# Altium project igbtDriver.PrjPcb
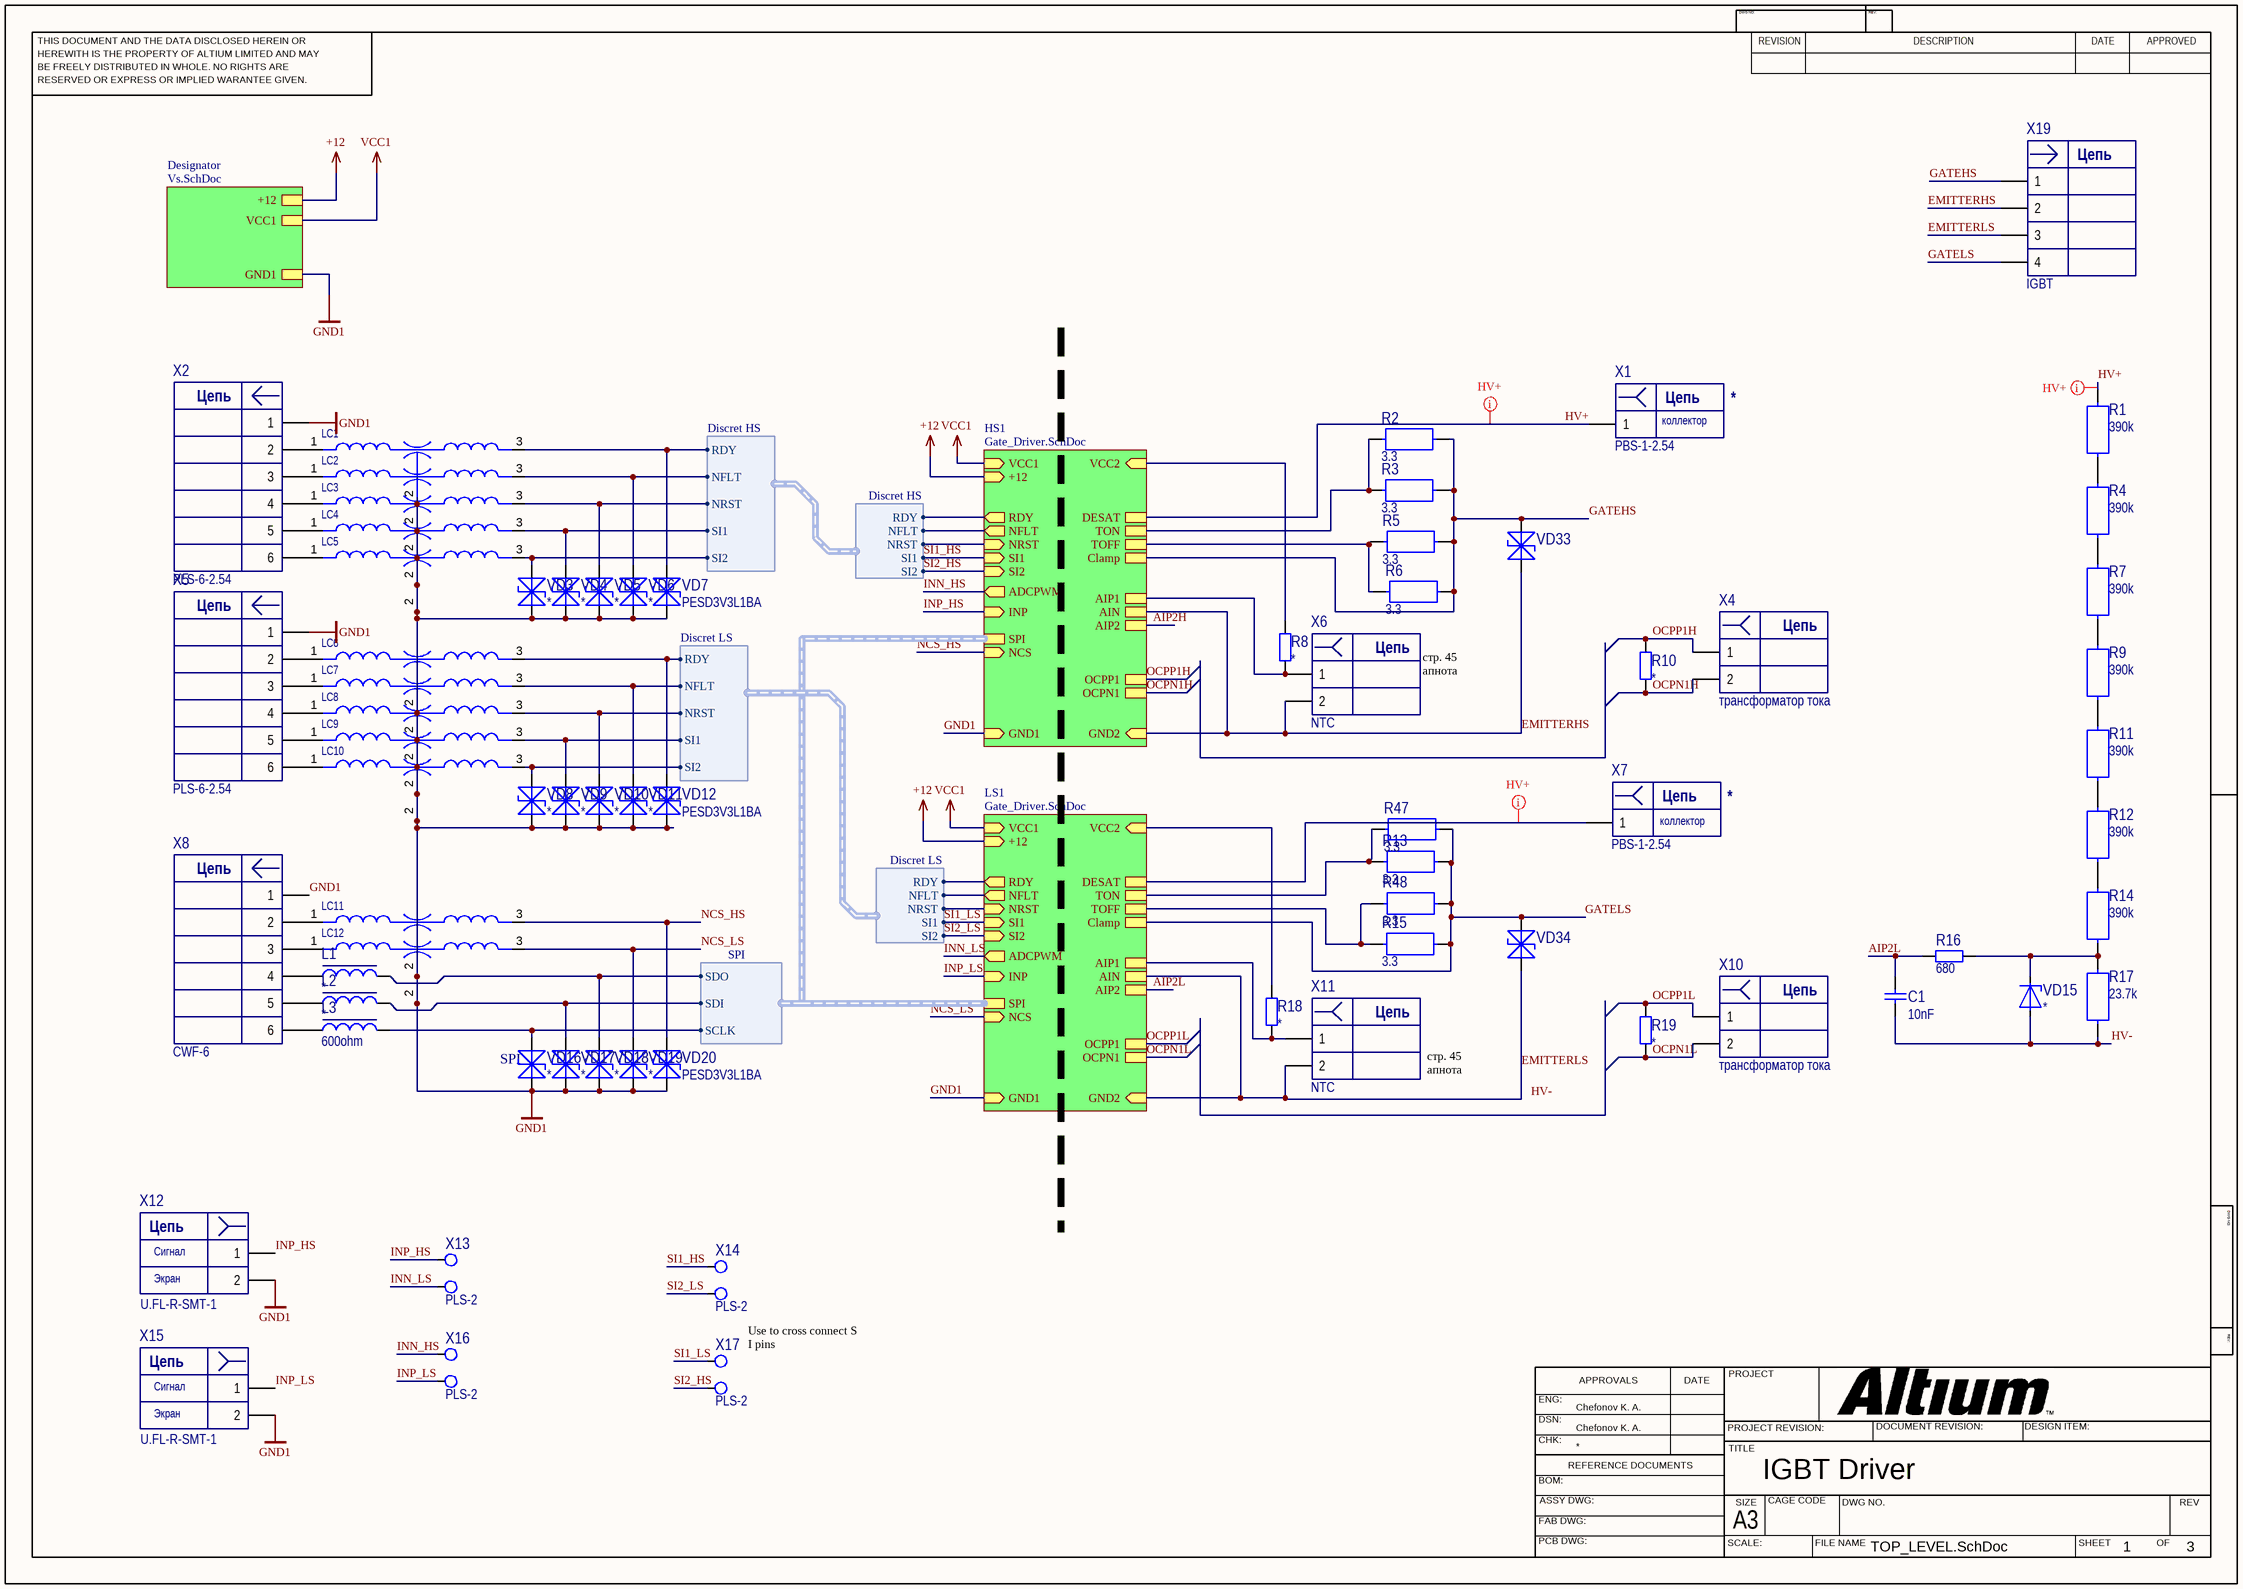
[diagram p0: TOP_LEVEL.SchDoc]
3 sheets, 239 parts. Net scope: strictly hierarchical (ports join the sheet entries above them; power ports are local).
Board file: PCB.PcbDoc
Sheets:
  TOP_LEVEL.SchDoc
    HS1 = Gate_Driver.SchDoc
    LS1 = Gate_Driver.SchDoc
    Designator = Vs.SchDoc

## Sheet TOP_LEVEL.SchDoc: IGBT Driver
size 420 x 297 mm; ApprovedBy: Chefonov K. A.; Author: Chefonov K. A.; CompanyName: Xtronik; DrawnBy: Chefonov K. A.; Engineer: Chefonov K. A.; Organization: Xtronik; Revision: 1; SheetNumber: 1; SheetTotal: 3

### Parts
C1  10nF  [2012[0805]]
L1  *  [2012[0805]]
L2  *  [2012[0805]]
L3  600ohm  [2012[0805]]
LC1  (no value)  [NFE61PT102E1H9L]
LC2  (no value)  [NFE61PT102E1H9L]
LC3  (no value)  [NFE61PT102E1H9L]
LC4  (no value)  [NFE61PT102E1H9L]
LC5  (no value)  [NFE61PT102E1H9L]
LC6  (no value)  [NFE61PT102E1H9L]
LC7  (no value)  [NFE61PT102E1H9L]
LC8  (no value)  [NFE61PT102E1H9L]
LC9  (no value)  [NFE61PT102E1H9L]
LC10  (no value)  [NFE61PT102E1H9L]
LC11  (no value)  [NFE61PT102E1H9L]
LC12  (no value)  [NFE61PT102E1H9L]
R1  390k  [3225[1210]]
R2  3.3  [2512]
R3  3.3  [2512]
R4  390k  [3225[1210]]
R5  3.3  [2512]
R6  3.3  [2512]
R7  390k  [3225[1210]]
R8  *  [2012[0805]]
R9  390k  [3225[1210]]
R10  *  [2012[0805]]
R11  390k  [3225[1210]]
R12  390k  [3225[1210]]
R13  3.3  [2012[0805]]
R14  390k  [3225[1210]]
R15  3.3  [2012[0805]]
R16  680  [2012[0805]]
R17  23.7k  [2012[0805]]
R18  *  [2012[0805]]
R19  *  [2012[0805]]
R47  3.3  [2012[0805]]
R48  3.3  [2012[0805]]
VD3  *  [SOD-323]
VD4  *  [SOD-323]
VD5  *  [SOD-323]
VD6  *  [SOD-323]
VD7  PESD3V3L1BA  [SOD-323]
VD8  *  [SOD-323]
VD9  *  [SOD-323]
VD10  *  [SOD-323]
VD11  *  [SOD-323]
VD12  PESD3V3L1BA  [SOD-323]
VD15  *  [SOD-123]
VD16  *  [SOD-323]
VD17  *  [SOD-323]
VD18  *  [SOD-323]
VD19  *  [SOD-323]
VD20  PESD3V3L1BA  [SOD-323]
VD33  (no value)  [SMС]
VD34  (no value)  [SMС]
X1  PBS-1-2.54  [PIN_1]
X2  PLS-6-2.54  [CWF-6]
X4  трансформатор тока  [CWF-2]
X5  PLS-6-2.54  [CWF-6]
X6  NTC  [CWF-2]
X7  PBS-1-2.54  [PIN_1]
X8  CWF-6  [CWF-6]
X10  трансформатор тока  [CWF-2]
X11  NTC  [CWF-2]
X12  U.FL-R-SMT-1  [PIN_2]
X13  PLS-2  [PIN_JUMPER]  (no BOM)
X14  PLS-2  [PIN_JUMPER]  (no BOM)
X15  U.FL-R-SMT-1  [PIN_2]
X16  PLS-2  [PIN_JUMPER]  (no BOM)
X17  PLS-2  [PIN_JUMPER]  (no BOM)
X19  IGBT  [IGBT]

### Sub-sheets
Designator = Vs.SchDoc: +12, GND1, VCC1
HS1 = Gate_Driver.SchDoc: GND2 (in), VCC2 (in), VCC1 (in), GND1 (in), TON, TOFF, Clamp, DESAT, OCPP1, OCPN1, AIP1, AIN, AIP2, +12 (in), SI1 (in), SI2 (in), NCS (in), NRST (in), NFLT (out), RDY (out), ADCPWM (out), INP (in), SPI (harness SPI)
LS1 = Gate_Driver.SchDoc: GND2 (in), VCC2 (in), VCC1 (in), GND1 (in), TON, TOFF, Clamp, DESAT, OCPP1, OCPN1, AIP1, AIN, AIP2, +12 (in), SI1 (in), SI2 (in), NCS (in), NRST (in), NFLT (out), RDY (out), ADCPWM (out), INP (in), SPI (harness SPI)

### Harnesses
SPI: SDO, SDI, SCLK
Discret HS: RDY, NFLT, NRST, SI1, SI2
Discret LS: RDY, NFLT, NRST, SI1, SI2

### Nets
+12: sheet HS1/+12, sheet LS1/+12, sheet Designator/+12
GND1: LC1.2(GND) LC2.2(GND) LC3.2(GND) LC4.2(GND) LC5.2(GND) LC6.2(GND) LC7.2(GND) LC8.2(GND) LC9.2(GND) LC10.2(GND) LC11.2(GND) LC12.2(GND) VD3.2(K) VD4.2(K) VD5.2(K) VD6.2(K) VD7.2(K) VD8.2(K) VD9.2(K) VD10.2(K) VD11.2(K) VD12.2(K) VD16.2(K) VD17.2(K) VD18.2(K) VD19.2(K) VD20.2(K) X2.1 X5.1 X8.1 X12.2 X15.2 ; sheet HS1/GND1, sheet LS1/GND1, sheet Designator/GND1
VCC1: sheet HS1/VCC1, sheet LS1/VCC1, sheet Designator/VCC1
AIP2L: C1.1 R16.2 ; sheet LS1/AIP2
EMITTERHS: VD33.2(K) X6.2 X19.2 ; sheet HS1/GND2, sheet HS1/AIN
EMITTERLS: VD34.2(K) X11.2 X19.3 ; sheet LS1/GND2, sheet LS1/AIN
GATEHS: R2.2 R3.2 R5.2 R6.2 VD33.1(A) X19.1 ; sheet HS1/Clamp
GATELS: R13.2 R15.2 R47.2 R48.2 VD34.1(A) X19.4 ; sheet LS1/Clamp
HV+: R1.2 X1.1 ; sheet HS1/DESAT
HV-: C1.2 R17.1 VD15.1(A)
INN_HS: X16.1 ; sheet HS1/ADCPWM
INN_LS: X13.2 ; sheet LS1/ADCPWM
INP_HS: X12.1 X13.1 ; sheet HS1/INP
INP_LS: X15.1 X16.2 ; sheet LS1/INP
NCS_HS: LC11.3(OUTPUT) VD20.1(A) ; sheet HS1/NCS
NCS_LS: LC12.3(OUTPUT) VD19.1(A) ; sheet LS1/NCS
OCPN1H: R10.1 X4.2 ; sheet HS1/OCPN1
OCPN1L: R19.1 X10.2 ; sheet LS1/OCPN1
OCPP1H: R10.2 X4.1 ; sheet HS1/OCPP1
OCPP1L: R19.2 X10.1 ; sheet LS1/OCPP1
SDO: L1.2 VD18.1(A) ; sheet HS1/SPI.SDO
SI1_HS: LC4.3(OUTPUT) VD4.1(A) X14.1 ; sheet HS1/SI1, harness Discret HS.SI1
SI1_LS: LC9.3(OUTPUT) VD9.1(A) X17.1 ; sheet LS1/SI1, harness Discret LS.SI1
SI2_HS: LC5.3(OUTPUT) VD3.1(A) X17.2 ; sheet HS1/SI2, harness Discret HS.SI2
SI2_LS: LC10.3(OUTPUT) VD8.1(A) X14.2 ; sheet LS1/SI2, harness Discret LS.SI2
VCC2: R8.2 ; sheet HS1/VCC2
VCC2: R18.2 ; sheet LS1/VCC2  [a separate net that carries the same name]
NetC10_HS1_1: LC3.3(OUTPUT) VD5.1(A) ; sheet HS1/NRST, harness Discret HS.NRST
NetC10_LS1_1: LC8.3(OUTPUT) VD10.1(A) ; sheet LS1/NRST, harness Discret LS.NRST
NetC13_HS1_1: R8.1 X6.1 ; sheet HS1/AIP1
NetC13_LS1_1: R18.1 X11.1 ; sheet LS1/AIP1
NetL1_1: L1.1 X8.4
NetL2_1: L2.1 X8.5
NetL2_2: L2.2 VD17.1(A) ; sheet HS1/SPI.SDI
NetL3_1: L3.1 X8.6
NetL3_2: L3.2 VD16.1(A) ; sheet HS1/SPI.SCLK
NetLC1_1: LC1.1(INPUT) X2.2
NetLC1_3: LC1.3(OUTPUT) VD7.1(A) ; sheet HS1/RDY, harness Discret HS.RDY
NetLC2_1: LC2.1(INPUT) X2.3
NetLC2_3: LC2.3(OUTPUT) VD6.1(A) ; sheet HS1/NFLT, harness Discret HS.NFLT
NetLC3_1: LC3.1(INPUT) X2.4
NetLC4_1: LC4.1(INPUT) X2.5
NetLC5_1: LC5.1(INPUT) X2.6
NetLC6_1: LC6.1(INPUT) X5.2
NetLC6_3: LC6.3(OUTPUT) VD12.1(A) ; sheet LS1/RDY, harness Discret LS.RDY
NetLC7_1: LC7.1(INPUT) X5.3
NetLC7_3: LC7.3(OUTPUT) VD11.1(A) ; sheet LS1/NFLT, harness Discret LS.NFLT
NetLC8_1: LC8.1(INPUT) X5.4
NetLC9_1: LC9.1(INPUT) X5.5
NetLC10_1: LC10.1(INPUT) X5.6
NetLC11_1: LC11.1(INPUT) X8.2
NetLC12_1: LC12.1(INPUT) X8.3
NetR1_1: R1.1 R4.2
NetR2_1: R2.1 R3.1 ; sheet HS1/TON
NetR4_1: R4.1 R7.2
NetR5_1: R5.1 R6.1 ; sheet HS1/TOFF
NetR7_1: R7.1 R9.2
NetR9_1: R9.1 R11.2
NetR11_1: R11.1 R12.2
NetR12_1: R12.1 R14.2
NetR13_1: R13.1 R47.1 ; sheet LS1/TON
NetR14_1: R14.1 R16.1 R17.2 VD15.2(K)
NetR15_1: R15.1 R48.1 ; sheet LS1/TOFF
NetVD21_LS1_2: X7.1 ; sheet LS1/DESAT

### Buses and harness runs
harness sheet HS1/SPI = sheet LS1/SPI

### Layout directives
mark named HV+: HV+, NetVD21_LS1_2

### Notes on the sheet
- (near X1) коллектор
- стр. 45 апнота
- (near X7) коллектор
- (near VD16) SPI
- Сигнал
- Экран
- Use to cross connect S
  I pins
- Labels drawn without touching a wire or pin: HV-
- THIS DOCUMENT AND THE DATA DISCLOSED HEREIN OR
- HEREWITH IS THE PROPERTY OF ALTIUM LIMITED AND MAY
- DWG NO:
- REVISION
- REV:
- DESCRIPTION
- DATE
- APPROVED
- BE FREELY DISTRIBUTED IN WHOLE. NO RIGHTS ARE
- RESERVED OR EXPRESS OR IMPLIED WARANTEE GIVEN.
- ENG:
- APPROVALS
- PROJECT
- DSN:
- CHK:
- REFERENCE DOCUMENTS
- PROJECT REVISION:
- TITLE
- DOCUMENT REVISION:
- DESIGN ITEM:
- BOM:
- FAB DWG:
- PCB DWG:
- ASSY DWG:
- SCALE:
- A3
- SIZE
- CAGE CODE
- FILE NAME
- DWG NO.
- SHEET
- OF
- REV
- (in symbol XP-PBS-1) Цепь
- (in symbol XP-PBS-2) Цепь
- (in symbol XP-PLD-6) Цепь
- (in symbol XP-PLS-4) Цепь
- (in symbol XP-PLS-6) Цепь

### Library data of the parts
C1 = C-4del: Конденсатор; Manufacturer: Murata; ManufacturerPartNumber: GRM21B X7R 104 50V; Power/Voltage: 50В; Value: 0.1; Tolerance: 10%; TKE/TKC: X7R; Specification: K; BCPId: *; Rem: *; Package: *; Type: Конденсатор; TU/GOST: *; Name: *; HelpURL: *; Price: *
L1-L3 = L with core: Дроссель; Type: Индуктивность; Specification: K; BCPId: *; Power/Voltage: *; Tolerance: *; Manufacturer: *; ManufacturerPartNumber: *; Rem: *; Package: *; Value: *; TU/GOST: *; Name: *; HelpURL: *; Price: *
LC1-LC12 = Фильтр ЭМП LCL
R1-R7 R9 R11-R15 R17 R47 R48 = R: Резистор; Manufacturer: Yageo; ManufacturerPartNumber: RC0805JR-07120R; Power/Voltage: 0.125Вт; Tolerance: 5%; Specification: K; BCPId: *; Rem: *; Package: *; Value: *; TU/GOST: *; Type: Резистор; Name: *; TKE/TKC: *; HelpURL: *; Price: *
R8 R10 R16 R18 R19 = R-4del: Резистор; Manufacturer: Yageo; ManufacturerPartNumber: RC0805JR-07120R; Power/Voltage: 0.125Вт; Tolerance: 5%; Specification: K; BCPId: *; Rem: *; Package: *; Value: *; TU/GOST: *; Type: Резистор; Name: *; TKE/TKC: *; HelpURL: *; Price: *
VD3-VD12 VD16-VD20 VD33 VD34 = VD Stabilitron_bidir: Стабилитрон двусторонний; Specification: K; BCPId: *; Manufacturer: *; Rem: *; Package: *; ManufacturerPartNumber: *; Type: Стабилитрон; TU/GOST: *; HelpURL: *; Price: *
VD15 = VD Stabilitron: Стабилитрон односторонний; Specification: K; BCPId: *; Manufacturer: *; Rem: *; Package: *; ManufacturerPartNumber: *; Type: Стабилитрон; TU/GOST: *; HelpURL: *; Price: *
X1 X7 = XP-PBS-1: Гнездо 1-контакт; Specification: K; BCPId: *; Manufacturer: *; ManufacturerPartNumber: PBS-1-2.54; Rem: *; Package: *; TU/GOST: *; Type: Розетка; HelpURL: *; Price: *; Text: *
X2 X5 = XP-PLS-6: Вилка на 6 контактов; Specification: K; System: Connector; BCPId: *; Manufacturer: *; ManufacturerPartNumber: PLS-6-2.54; Rem: *; Package: *; TU/GOST: *; Type: Вилка; HelpURL: *; Price: *
X4 X6 X10-X12 X15 = XP-PBS-2: Гнездо 2-контакта; ManufacturerPartNumber: PBS-2-2.54; Specification: K; BCPId: *; Manufacturer: *; Rem: *; Package: *; TU/GOST: *; Type: Розетка; HelpURL: *; Price: *
X8 = XP-PLD-6: Вилка 6 контактов в 2 ряда; ManufacturerPartNumber: PLD-6-2.54; Specification: K; System: Connector; BCPId: *; Manufacturer: *; Rem: *; Package: *; TU/GOST: *; Type: Вилка; HelpURL: *; Price: *
X13 X14 X16 X17 = Джампер 2-контакта: Specification: K; BCPId: *; Manufacturer: *; ManufacturerPartNumber: PLS-2; Rem: *; Package: *; TU/GOST: *; Type: Контакты; HelpURL: *; Price: *
X19 = XP-PLS-4: Вилка на 4 контакта; ManufacturerPartNumber: PLS-4-2.54; Specification: K; BCPId: *; Manufacturer: *; Rem: *; Package: *; TU/GOST: *; Type: Вилка; HelpURL: *; Price: *

## Sheet Gate_Driver.SchDoc
size A4; SheetNumber: 2; SheetTotal: 3
Used 2 times, as channels HS1, LS1. Parts and nets are listed once, with the designators drawn on the sheet.
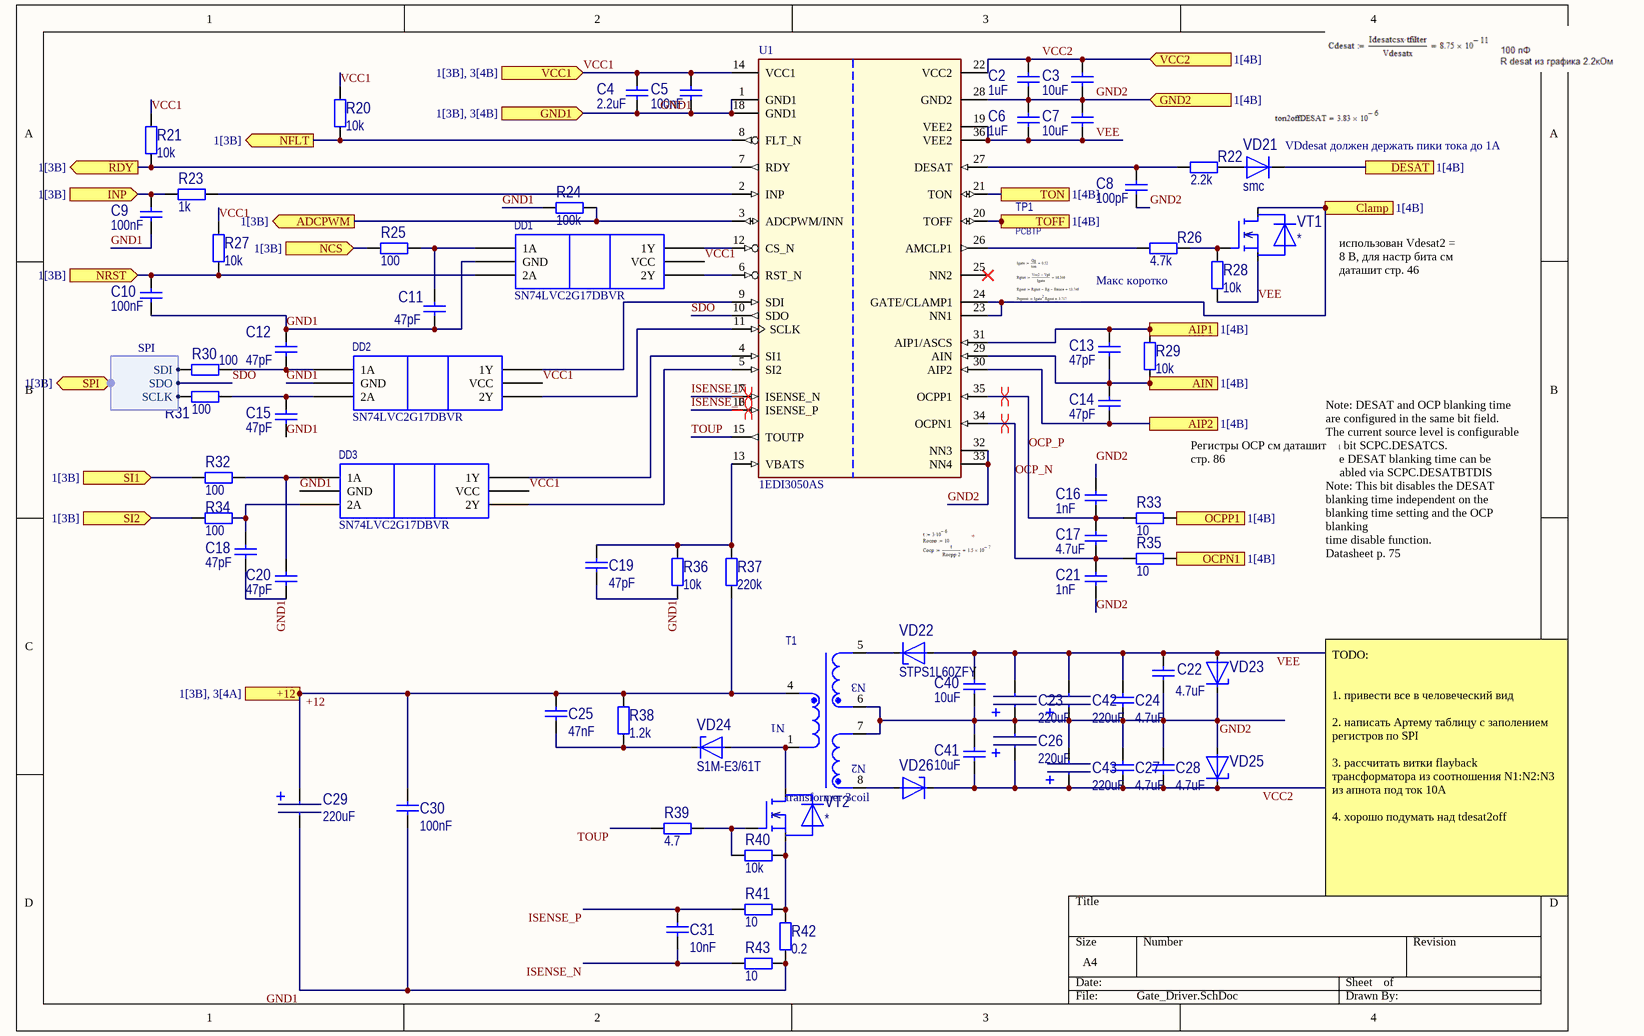
[diagram p1: Gate_Driver.SchDoc]

### Parts
C2  1uF  [6332[2512]]
C3  10uF  [6332[2512]]
C4  2.2uF  [3216[1206]]
C5  100nF  [2012[0805]]
C6  1uF  [6332[2512]]
C7  10uF  [6332[2512]]
C8  100pF  [2012[0805]]
C9  100nF  [2012[0805]]
C10  100nF  [2012[0805]]
C11  47pF  [2012[0805]]
C12  47pF  [2012[0805]]
C13  47pF  [2012[0805]]
C14  47pF  [2012[0805]]
C15  47pF  [2012[0805]]
C16  1nF  [2012[0805]]
C17  4.7uF  [2012[0805]]
C18  47pF  [2012[0805]]
C19  47pF  [2012[0805]]
C20  47pF  [2012[0805]]
C21  1nF  [2012[0805]]
C22  4.7uF  [6332[2512]]
C23  220uF  [ECAP 220 50V]
C24  4.7uF  [6332[2512]]
C25  47nF  [2012[0805]]
C26  220uF  [ECAP 220 50V]
C27  4.7uF  [6332[2512]]
C28  4.7uF  [6332[2512]]
C29  220uF  [A(3216)]
C30  100nF  [6332[2512]]
C31  10nF  [1005[0402]]
C40  10uF  [6332[2512]]
C41  10uF  [6332[2512]]
C42  220uF  [ECAP 220 50V]
C43  220uF  [ECAP 220 50V]
DD1  SN74LVC2G17DBVR  [SOT23-6]
DD2  SN74LVC2G17DBVR  [SOT23-6]
DD3  SN74LVC2G17DBVR  [SOT23-6]
R20  10k  [2012[0805]]
R21  10k  [2012[0805]]
R22  2.2k  [3216[1206]]
R23  1k  [2012[0805]]
R24  100k  [1005[0402]]
R25  100  [2012[0805]]
R26  4.7k  [2012[0805]]
R27  10k  [2012[0805]]
R28  10k  [2012[0805]]
R29  10k  [2012[0805]]
R30  100  [2012[0805]]
R31  100  [2012[0805]]
R32  100  [2012[0805]]
R33  10  [2012[0805]]
R34  100  [2012[0805]]
R35  10  [2012[0805]]
R36  10k  [2012[0805]]
R37  220k  [2012[0805]]
R38  1.2k  [2012[0805]]
R39  4.7  [2012[0805]]
R40  10k  [2012[0805]]
R41  10  [2012[0805]]
R42  0.2  [2512]
R43  10  [2012[0805]]
T1  transformer 3coil  [E 13/7/4]
TP1  PCBTP
U1  1EDI3050AS
VD21  smc  [SMС]
VD22  STPS1L60ZFY  [SOD-123]
VD23  (no value)  [SMС]
VD24  S1M-E3/61T  [SMB]
VD25  (no value)  [SMС]
VD26  (no value)  [SOD-123]
VT1  *
VT2  *

### Ports
+12 (in, see 1[3B], 3[4A]), ADCPWM (out, see 1[3B]), AIN (see 1[4B]), AIP1 (see 1[4B]), AIP2 (see 1[4B]), Clamp (see 1[4B]), DESAT (see 1[4B]), GND1 (in, see 1[3B], 3[4B]), GND2 (in, see 1[4B]), INP (in, see 1[3B]), NCS (in, see 1[3B]), NFLT (out, see 1[3B]), NRST (in, see 1[3B]), OCPN1 (see 1[4B]), OCPP1 (see 1[4B]), RDY (out, see 1[3B]), SI1 (in, see 1[3B]), SI2 (in, see 1[3B]), SPI (bidir, harness SPI, see 1[3B]), TOFF (see 1[4B]), TON (see 1[4B]), VCC1 (in, see 1[3B], 3[4B]), VCC2 (in, see 1[4B])

### Harnesses
SPI: SDI, SDO, SCLK

### Nets
+12: C25.1 C29.1 C30.1 R37.1 R38.2 T1.4 ; port +12
ADCPWM: R24.1 U1.3(ADCPWM/INN) ; port ADCPWM
AIN: C13.2 C14.1 R29.1 U1.29(AIN) ; port AIN
AIP1: C13.1 R29.2 U1.31(AIP1/ASCS) ; port AIP1
AIP2: C14.2 U1.30(AIP2) ; port AIP2
Clamp: U1.23(NN1) U1.24(GATE/CLAMP1) VT1.1(D) ; port Clamp
DESAT: VD21.2(K) ; port DESAT
GND1: C4.2 C5.2 C9.2 C10.2 C11.2 C12.1 C15.2 C18.2 C19.2 C20.2 C29.2 C30.2 DD1.2(GND) DD2.2(GND) DD3.2(GND) R24.2 R36.1 R42.2 R43.1 U1.1(GND1) U1.18(GND1) ; port GND1
GND2: C2.2 C3.2 C6.1 C7.1 C8.2 C16.1 C21.2 C22.1 C23.1 C24.1 C26.2 C27.2 C28.2 C40.2 C41.1 C42.1 C43.2 T1.6 T1.7 U1.28(GND2) U1.32(NN3) U1.33(NN4) VD23.2(K) VD25.1(A) ; port GND2
INP: C9.1 R23.2 ; port INP
ISENSE_N: C31.2 R43.2 U1.17(ISENSE_N)
ISENSE_P: C31.1 R41.2 U1.16(ISENSE_P)
NCS: R25.2 ; port NCS
NFLT: R20.1 U1.8(FLT_N) ; port NFLT
NRST: C10.1 DD1.3(2A) R27.1 ; port NRST
OCP_N: C17.2 C21.1 R35.2 U1.34(OCPN1)
OCP_P: C16.2 C17.1 R33.2 U1.35(OCPP1)
OCPN1: R35.1 ; port OCPN1
OCPP1: R33.1 ; port OCPP1
RDY: R21.1 U1.7(RDY) ; port RDY
SDO: U1.10(SDO) ; port SPI.SDO
SI1: R32.2 ; port SI1
SI2: R34.2 ; port SI2
TOFF: TP1.1 U1.20(TOFF) ; port TOFF
TON: U1.21(TON) ; port TON
TOUP: R39.1 U1.15(TOUTP)
VCC1: C4.1 C5.1 DD1.5(VCC) DD2.5(VCC) DD3.5(VCC) R20.2 R21.2 R27.2 U1.14(VCC1) ; port VCC1
VCC2: C2.1 C3.1 C26.1 C27.1 C28.1 C41.2 C43.1 U1.22(VCC2) VD25.2(K) VD26.2(K) ; port VCC2
VEE: C6.2 C7.2 C22.2 C23.2 C24.2 C40.1 C42.2 R28.1 U1.19(VEE2) U1.36(VEE2) VD22.1(A) VD23.1(A) VT1.3(S)
NetC8_1: C8.1 R22.1 U1.27(DESAT)
NetC11_1: C11.1 DD1.1(1A) R25.1
NetC12_2: C12.2 DD2.1(1A) R30.1
NetC15_1: C15.1 DD2.3(2A) R31.1
NetC18_1: C18.1 DD3.3(2A) R34.1
NetC19_1: C19.1 R36.2 R37.2 U1.13(VBATS)
NetC20_1: C20.1 DD3.1(1A) R32.1
NetC25_2: C25.2 R38.1 VD24.2(K)
NetDD1_4: DD1.4(2Y) U1.6(RST_N)
NetDD1_6: DD1.6(1Y) U1.12(CS_N)
NetDD2_4: DD2.4(2Y) U1.11(SCLK)
NetDD2_6: DD2.6(1Y) U1.9(SDI)
NetDD3_4: DD3.4(2Y) U1.5(SI2)
NetDD3_6: DD3.6(1Y) U1.4(SI1)
NetR22_2: R22.2 VD21.1(A)
NetR23_1: R23.1 U1.2(INP)
NetR26_1: R26.1 U1.26(AMCLP1)
NetR26_2: R26.2 R28.2 VT1.2(G)
NetR30_2: R30.2 ; port SPI.SDI
NetR31_2: R31.2 ; port SPI.SCLK
NetR39_2: R39.2 R40.2 VT2.2(G)
NetR40_1: R40.1 R41.1 R42.1 VT2.3(S)
NetT1_1: T1.1 VD24.1(A) VT2.1(D)
NetT1_5: T1.5 VD22.2(K)
NetT1_8: T1.8 VD26.1(A)

Not connected (* = marked no-connect by the designer): U1 25(NN2)*

### Channels
HS1: designators end in _HS1; ports +12=+12 ADCPWM=INN_HS AIN=EMITTERHS AIP1=NetC13_HS1_1 AIP2=AIP2H Clamp=GATEHS DESAT=HV+ GND1=GND1 GND2=EMITTERHS INP=INP_HS NCS=NCS_HS NFLT=NetLC2_3 NRST=NetC10_HS1_1 OCPN1=OCPN1H OCPP1=OCPP1H RDY=NetLC1_3 SI1=SI1_HS SI2=SI2_HS TOFF=NetR5_1 TON=NetR2_1 VCC1=VCC1 VCC2=VCC2
LS1: designators end in _LS1; ports +12=+12 ADCPWM=INN_LS AIN=EMITTERLS AIP1=NetC13_LS1_1 AIP2=AIP2L Clamp=GATELS DESAT=NetVD21_LS1_2 GND1=GND1 GND2=EMITTERLS INP=INP_LS NCS=NCS_LS NFLT=NetLC7_3 NRST=NetC10_LS1_1 OCPN1=OCPN1L OCPP1=OCPP1L RDY=NetLC6_3 SI1=SI1_LS SI2=SI2_LS TOFF=NetR15_1 TON=NetR13_1 VCC1=VCC1 VCC2=VCC2

### Layout directives
differential pair: ISENSE_N_HS1, ISENSE_P_HS1, OCP_N_HS1, OCP_P_HS1

### Notes on the sheet
- (near VD21) VDdesat должен держать пики тока до 1А
- (near R26) Макс коротко
- использован Vdesat2 = 8 В, для настр бита см даташит стр. 46
- (near R33) Регистры OCP см даташит стр. 86
- Note: DESAT and OCP blanking time are configured in the same bit field.
  The current source level is configurable via bit SCPC.DESATCS.
  The DESAT blanking time can be disabled via SCPC.DESATBTDIS
  Note: This bit disables the DESAT blanking time independent on the blanking time setting and the OCP blanking
  time disable function.
  Datasheet p. 75
- TODO:
  1. привести все в человеческий вид
  2. написать Артему таблицу с заполением регистров по SPI
  3. рассчитать витки flayback трансформатора из соотношения N1:N2:N3 из апнота под ток 10А
  4. хорошо подумать над tdesat2off
- (in symbol transformer 3coil) N3; N1; N2

### Library data of the parts
C2-C22 C24 C25 C27 C28 C30 C31 C40 C41 = C-4del: as C1 on sheet TOP_LEVEL; BCPId: *; Rem: *; Package: *; Type: Конденсатор; TU/GOST: *; Name: *; HelpURL: *; Price: *
C23 C26 C29 C42 C43 = C pol: Конденсатор электролитический; Specification: K; BCPId: *; Power/Voltage: *; Manufacturer: *; ManufacturerPartNumber: *; Rem: *; Package: *; Value: *; Type: Конденсатор; TU/GOST: *; Name: *; TKE/TKC: *; HelpURL: *; Price: *
DD1-DD3 = SN74LVC
R20-R43 = R-4del: as R8 on sheet TOP_LEVEL; BCPId: *; Rem: *; Package: *; Value: *; TU/GOST: *; Type: Резистор; Name: *; TKE/TKC: *; HelpURL: *; Price: *
TP1 = Testpoint
U1 = 1EDI3050AS: Single channel isolated IGBT/SiC-MOSFET driver; Manufacturer: Infineon Technologies; Manufacturer Order Number: 1EDI3050AS; PackageReference: PG-DSO-36-63
VD21 = VD Diod: Диод; Specification: K; BCPId: *; Manufacturer: *; Rem: *; Package: *; ManufacturerPartNumber: *; Type: Диод; TU/GOST: *; HelpURL: *; Price: *
VD22-VD26 = VD Stabilitron: as VD15 on sheet TOP_LEVEL; BCPId: *; Manufacturer: *; Rem: *; Package: *; ManufacturerPartNumber: *; Type: Стабилитрон; TU/GOST: *; HelpURL: *; Price: *
VT1 VT2 = VT Transistor NMOS+D: Транзистор полевой n-канальный; Specification: K; BCPId: *; Manufacturer: *; Rem: *; Package: *; ManufacturerPartNumber: *; Type: Транзистор; TU/GOST: *; HelpURL: *; Price: *

## Sheet Vs.SchDoc
size A4; SheetNumber: 3; SheetTotal: 3
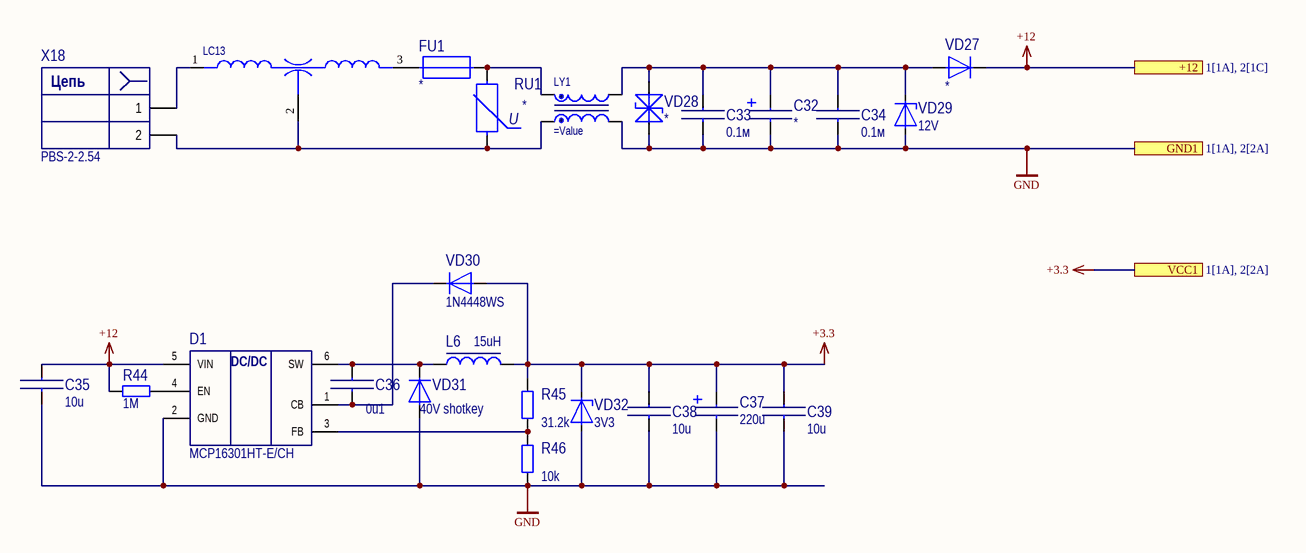
[diagram p2: Vs.SchDoc]

### Parts
C32  *  [ECAP 220 50V]
C33  0.1м  [3216[1206]]
C34  0.1м  [3216[1206]]
C35  10u  [3216[1206]]
C36  0u1  [2012[0805]]
C37  220u  [ECAP 220 50V]
C38  10u  [6332[2512]]
C39  10u  [6332[2512]]
D1  MCP16301HT-E/CH  [SOT23-6]
FU1  *  [2410]
L6  15uH  [IND5750]
LC13  (no value)  [NFE61PT102E1H9L]
LY1  (no value)  [B82793S0513N201]
R44  1М  [2012[0805]]
R45  31.2k  [2012[0805]]
R46  10k  [2012[0805]]
RU1  *  [3225[1210]]
VD27  *  [SMB]
VD28  *  [SMС]
VD29  12V  [SMС]
VD30  1N4448WS  [SOD-323]
VD31  40V shotkey  [SOD-123]
VD32  3V3  [SOD-80]
X18  PBS-2-2.54  [CWF-2]

### Ports
+12 (see 1[1A], 2[1C]), GND1 (see 1[1A], 2[2A]), VCC1 (see 1[1A], 2[2A])

### Nets
+3.3: C37.1 C38.1 C39.1 L6.2 R45.2 VD30.1(A) VD32.2(K) ; port VCC1  [project net VCC1]
+12: C35.1 D1.5(VIN) R44.2 VD27.2(K) ; port +12
GND: C32.2 C33.2 C34.2 C35.2 C37.2 C38.2 C39.2 D1.2(GND) LY1.4 R46.1 VD28.2(K) VD29.1(A) VD31.1(A) VD32.1(A) ; port GND1  [project net GND1]
NetC32_1: C32.1 C33.1 C34.1 LY1.3 VD27.1(A) VD28.1(A) VD29.2(K)
NetC36_1: C36.1 D1.1(CB) VD30.2(K)
NetC36_2: C36.2 D1.6(SW) L6.1 VD31.2(K)
NetD1_3: D1.3(FB) R45.1 R46.2
NetD1_4: D1.4(EN) R44.1
NetFU1_1: FU1.1 LC13.3(OUTPUT)
NetFU1_2: FU1.2 LY1.1 RU1.2
NetLC13_1: LC13.1(INPUT) X18.1
NetLC13_2: LC13.2(GND) LY1.2 RU1.1 X18.2

### Notes on the sheet
- (in symbol MCP16301) DC/DC
- (in symbol RU Varistor) U
- (in symbol XP-PBS-2) Цепь

### Library data of the parts
C32 C37 = C pol: as C23 on sheet Gate_Driver; BCPId: *; Power/Voltage: *; Manufacturer: *; ManufacturerPartNumber: *; Rem: *; Package: *; Value: *; Type: Конденсатор; TU/GOST: *; Name: *; TKE/TKC: *; HelpURL: *; Price: *
C33 C34 = C nonpol: Конденсатор; Manufacturer: Murata; ManufacturerPartNumber: GRM21_R71H104; Power/Voltage: 50В; Tolerance: 10%; TKE/TKC: X7R; Specification: K; BCPId: *; Rem: *; Package: *; Value: 0.1м; Type: Конденсатор; TU/GOST: *; Name: *; HelpURL: *; Price: *
C35 C36 C38 C39 = C nonpol: Конденсатор; Manufacturer: Murata; ManufacturerPartNumber: GRM21_R71H104; Power/Voltage: 50В; Value: 0.1м; Tolerance: 10%; TKE/TKC: X7R; Specification: K; BCPId: *; Rem: *; Package: *; Type: Конденсатор; TU/GOST: *; Name: *; HelpURL: *; Price: *
D1 = MCP16301: DC/DC regulator; Manufacturer: Microchip; Type: Микросхема; ManufacturerPartNumber: MCP16301HT-E/CH
FU1 = FU: Вставка плавкая; ManufacturerPartNumber: ВП1-2; Power/Voltage: 0.25 А, 250 В; TU/GOST: ОЮ0.480.003ТУ-Р; Specification: K; BCPId: *; Tolerance: *; Rem: *; Package: *; Value: *; Type: Вставка плавкая; Name: *; TKE/TKC: *; HelpURL: *; Price: *
L6 = L with core: as L1 on sheet TOP_LEVEL; BCPId: *; Power/Voltage: *; Tolerance: *; Manufacturer: *; ManufacturerPartNumber: *; Rem: *; Package: *; Value: *; TU/GOST: *; Name: *; HelpURL: *; Price: *
LC13 = Фильтр ЭМП LCL
LY1 = Дроссель синфазный
R44-R46 = R-4del: as R8 on sheet TOP_LEVEL; BCPId: *; Rem: *; Package: *; Value: *; TU/GOST: *; Type: Резистор; Name: *; TKE/TKC: *; HelpURL: *; Price: *
RU1 = RU Varistor: Варистор; Specification: K; BCPId: *; Manufacturer: *; Rem: *; Package: *; ManufacturerPartNumber: *; Type: Варистор; TU/GOST: *; HelpURL: *; Price: *
VD27 VD30 VD31 = VD Diod: Диод; Specification: K; BCPId: *; Manufacturer: *; Rem: *; Package: *; ManufacturerPartNumber: *; Type: Диод; TU/GOST: *; HelpURL: *; Price: *
VD28 = VD Stabilitron_bidir: as VD3 on sheet TOP_LEVEL; BCPId: *; Manufacturer: *; Rem: *; Package: *; ManufacturerPartNumber: *; Type: Стабилитрон; TU/GOST: *; HelpURL: *; Price: *
VD29 VD32 = VD Stabilitron: as VD15 on sheet TOP_LEVEL; BCPId: *; Manufacturer: *; Rem: *; Package: *; ManufacturerPartNumber: *; Type: Стабилитрон; TU/GOST: *; HelpURL: *; Price: *
X18 = XP-PBS-2: Гнездо 2-контакта; Specification: K; BCPId: *; Manufacturer: *; ManufacturerPartNumber: PBS-2-2.54; Rem: *; Package: *; TU/GOST: *; Type: Розетка; HelpURL: *; Price: *

## Nets that join several sheets
+12: HS1 (6 pins), LS1 (6 pins), Vs (C35.1 D1.5 R44.2 VD27.2)
GND1: TOP_LEVEL (32 pins), HS1 (21 pins), LS1 (21 pins), Vs (14 pins)
VCC1: HS1 (9 pins), LS1 (9 pins), Vs (7 pins)
AIP2L: TOP_LEVEL (C1.1 R16.2), LS1 (C14_LS1.2 U1_LS1.30)
EMITTERHS: TOP_LEVEL (VD33.2 X6.2 X19.2), HS1 (28 pins)
EMITTERLS: TOP_LEVEL (VD34.2 X11.2 X19.3), LS1 (28 pins)
GATEHS: TOP_LEVEL (6 pins), HS1 (U1_HS1.23 U1_HS1.24 VT1_HS1.1)
GATELS: TOP_LEVEL (6 pins), LS1 (U1_LS1.23 U1_LS1.24 VT1_LS1.1)
HV+: TOP_LEVEL (R1.2 X1.1), HS1 (VD21_HS1.2)
INN_HS: TOP_LEVEL (X16.1), HS1 (R24_HS1.1 U1_HS1.3)
INN_LS: TOP_LEVEL (X13.2), LS1 (R24_LS1.1 U1_LS1.3)
INP_HS: TOP_LEVEL (X12.1 X13.1), HS1 (C9_HS1.1 R23_HS1.2)
INP_LS: TOP_LEVEL (X15.1 X16.2), LS1 (C9_LS1.1 R23_LS1.2)
NCS_HS: TOP_LEVEL (LC11.3 VD20.1), HS1 (R25_HS1.2)
NCS_LS: TOP_LEVEL (LC12.3 VD19.1), LS1 (R25_LS1.2)
NetC10_HS1_1: TOP_LEVEL (LC3.3 VD5.1), HS1 (C10_HS1.1 DD1_HS1.3 R27_HS1.1)
NetC10_LS1_1: TOP_LEVEL (LC8.3 VD10.1), LS1 (C10_LS1.1 DD1_LS1.3 R27_LS1.1)
NetC13_HS1_1: TOP_LEVEL (R8.1 X6.1), HS1 (C13_HS1.1 R29_HS1.2 U1_HS1.31)
NetC13_LS1_1: TOP_LEVEL (R18.1 X11.1), LS1 (C13_LS1.1 R29_LS1.2 U1_LS1.31)
NetL2_2: TOP_LEVEL (L2.2 VD17.1), HS1 (R30_HS1.2), LS1 (R30_LS1.2)
NetL3_2: TOP_LEVEL (L3.2 VD16.1), HS1 (R31_HS1.2), LS1 (R31_LS1.2)
NetLC1_3: TOP_LEVEL (LC1.3 VD7.1), HS1 (R21_HS1.1 U1_HS1.7)
NetLC2_3: TOP_LEVEL (LC2.3 VD6.1), HS1 (R20_HS1.1 U1_HS1.8)
NetLC6_3: TOP_LEVEL (LC6.3 VD12.1), LS1 (R21_LS1.1 U1_LS1.7)
NetLC7_3: TOP_LEVEL (LC7.3 VD11.1), LS1 (R20_LS1.1 U1_LS1.8)
NetR2_1: TOP_LEVEL (R2.1 R3.1), HS1 (U1_HS1.21)
NetR5_1: TOP_LEVEL (R5.1 R6.1), HS1 (TP1_HS1.1 U1_HS1.20)
NetR13_1: TOP_LEVEL (R13.1 R47.1), LS1 (U1_LS1.21)
NetR15_1: TOP_LEVEL (R15.1 R48.1), LS1 (TP1_LS1.1 U1_LS1.20)
NetVD21_LS1_2: TOP_LEVEL (X7.1), LS1 (VD21_LS1.2)
OCPN1H: TOP_LEVEL (R10.1 X4.2), HS1 (R35_HS1.1)
OCPN1L: TOP_LEVEL (R19.1 X10.2), LS1 (R35_LS1.1)
OCPP1H: TOP_LEVEL (R10.2 X4.1), HS1 (R33_HS1.1)
OCPP1L: TOP_LEVEL (R19.2 X10.1), LS1 (R33_LS1.1)
SDO: TOP_LEVEL (L1.2 VD18.1), HS1 (U1_HS1.10), LS1 (U1_LS1.10)
SI1_HS: TOP_LEVEL (LC4.3 VD4.1 X14.1), HS1 (R32_HS1.2)
SI1_LS: TOP_LEVEL (LC9.3 VD9.1 X17.1), LS1 (R32_LS1.2)
SI2_HS: TOP_LEVEL (LC5.3 VD3.1 X17.2), HS1 (R34_HS1.2)
SI2_LS: TOP_LEVEL (LC10.3 VD8.1 X14.2), LS1 (R34_LS1.2)
VCC2: TOP_LEVEL (R8.2), HS1 (10 pins)
VCC2: TOP_LEVEL (R18.2), LS1 (10 pins)